# EAGLE design helmholtz-distribution-pcb (EAGLE 9.5.1)
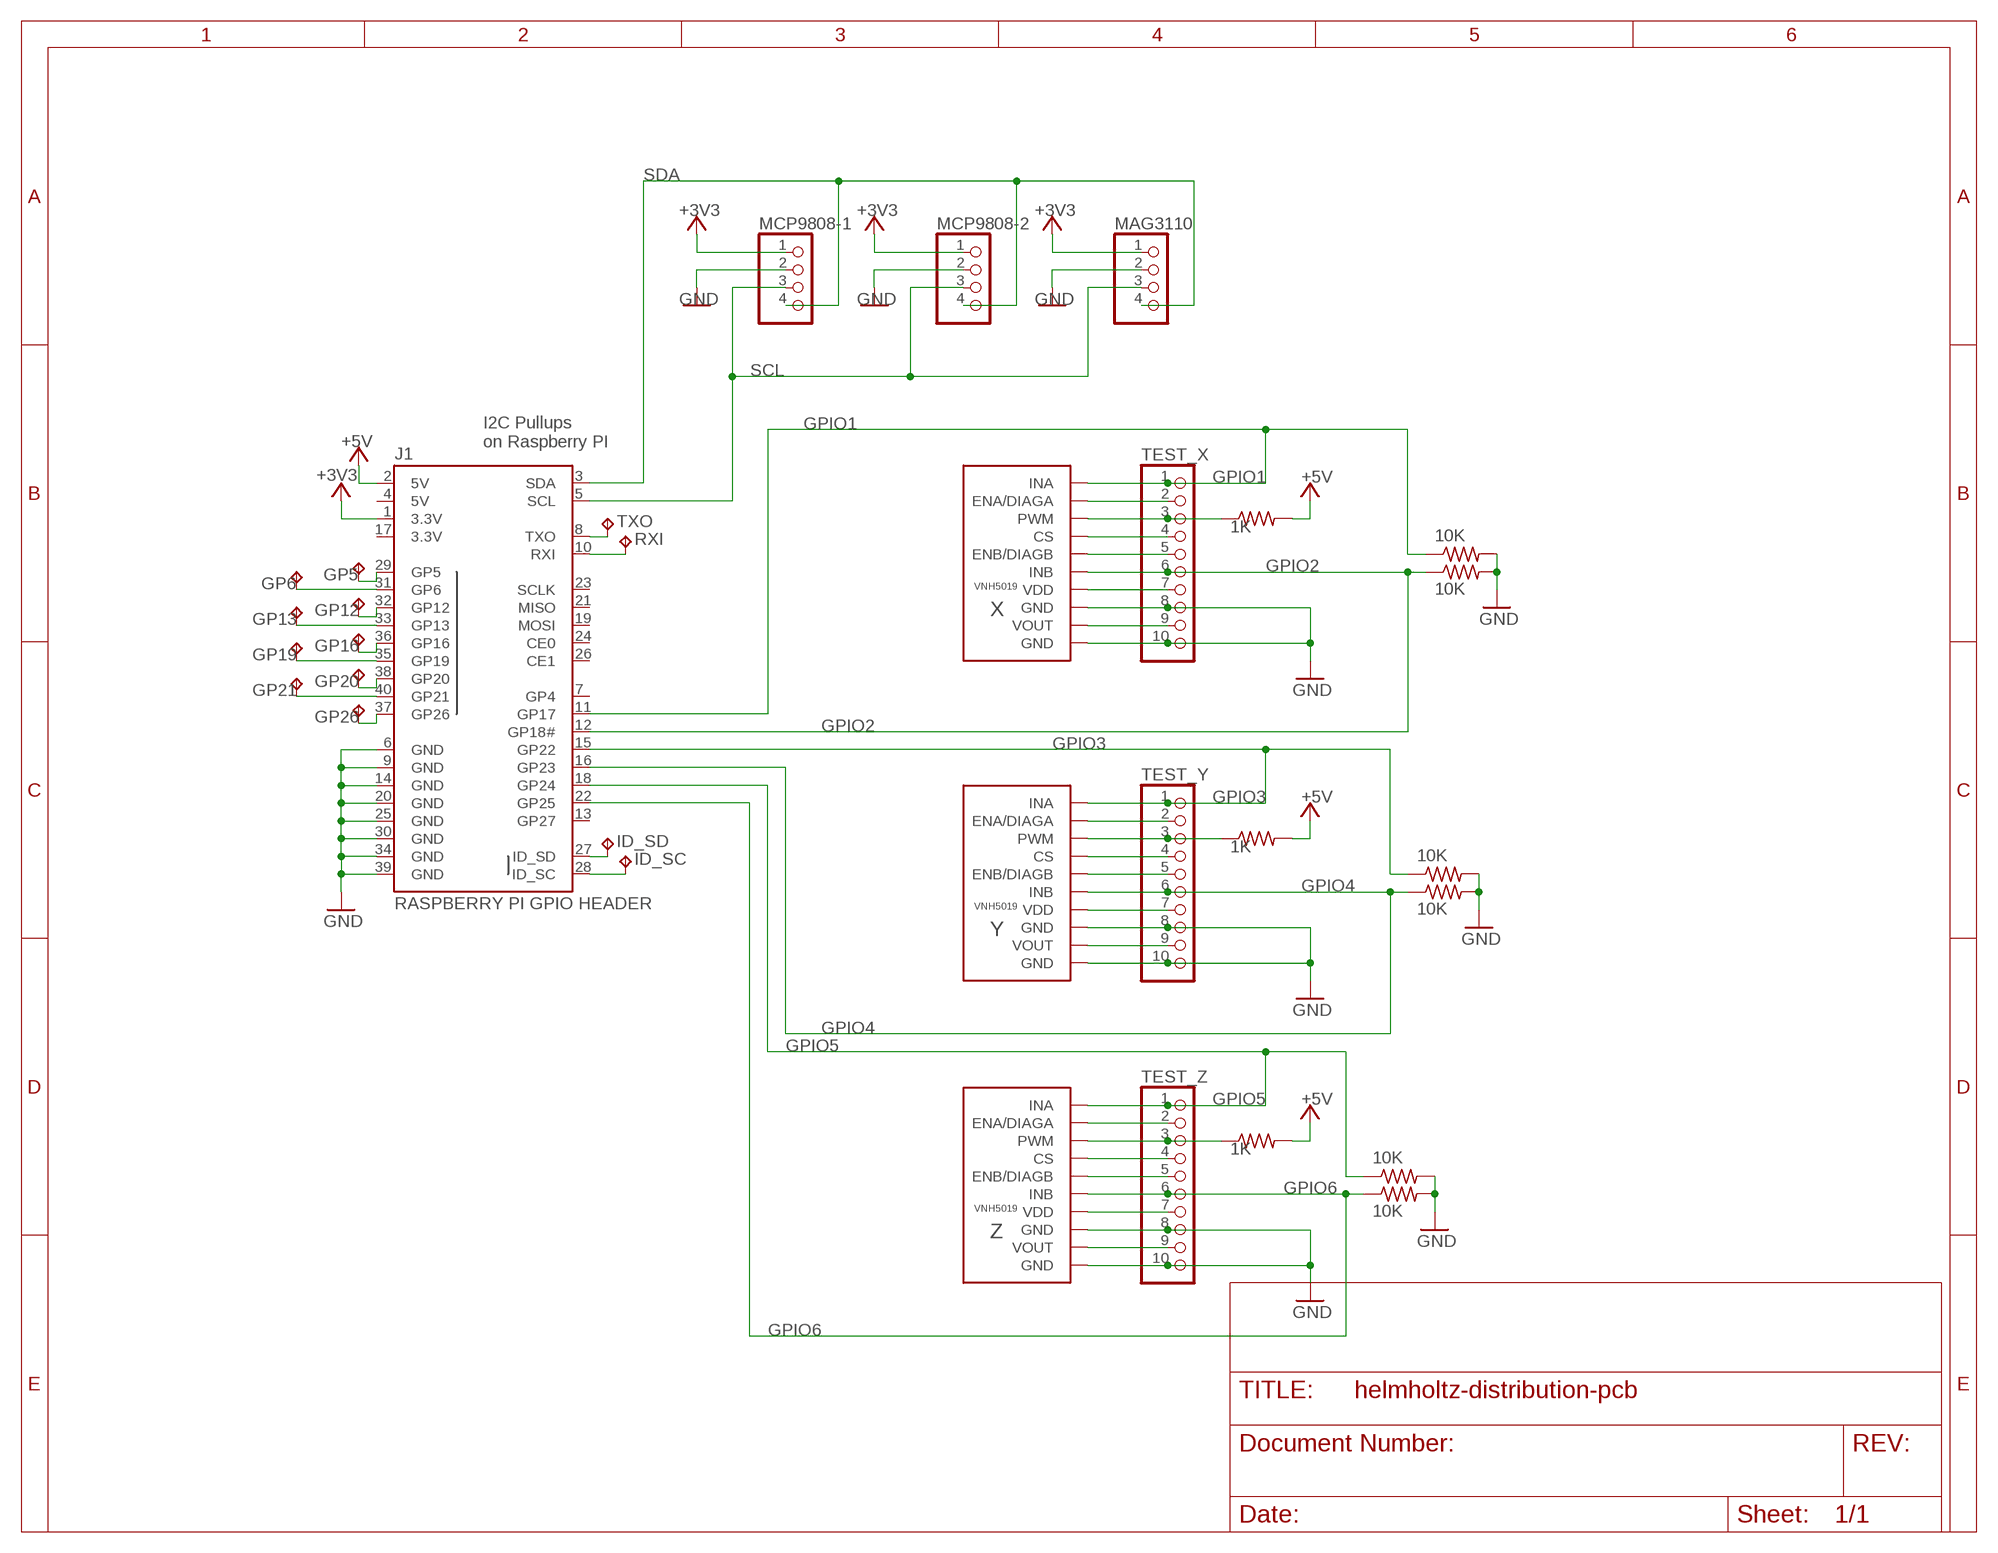
[diagram p0: schematic, sheet 1]

## Parts
GP5  TPPAD1-13  [P1-13]
GP6  TPPAD1-13  [P1-13]
GP12  TPPAD1-13  [P1-13]
GP13  TPPAD1-13  [P1-13]
GP16  TPPAD1-13  [P1-13]
GP19  TPPAD1-13  [P1-13]
GP20  TPPAD1-13  [P1-13]
GP21  TPPAD1-13  [P1-13]
GP26  TPPAD1-13  [P1-13]
ID_SC  TPPAD1-13  [P1-13]
ID_SD  TPPAD1-13  [P1-13]
J1  RASPBERRYPI-40-PIN-GPIO_PTH  [2X20_SHROUDED]
MAG3110  PINHD-1X4  [1X04]
MCP9808-1  PINHD-1X4  [1X04]
MCP9808-2  PINHD-1X4  [1X04]
R2  10K  R-US_R0603  [R0603]
R3  10K  R-US_R0603  [R0603]
R7  1K  R-US_R0603  [R0603]
R9  10K  R-US_R0603  [R0603]
R10  10K  R-US_R0603  [R0603]
R13  1K  R-US_R0603  [R0603]
R16  10K  R-US_R0603  [R0603]
R17  10K  R-US_R0603  [R0603]
R20  1K  R-US_R0603  [R0603]
RXI  TPPAD1-13  [P1-13]
TEST_X  PINHD-1X10  [1X10]
TEST_Y  PINHD-1X10  [1X10]
TEST_Z  PINHD-1X10  [1X10]
TXO  TPPAD1-13  [P1-13]
X  VNH5019  [VNH5019]
Y  VNH5019  [VNH5019]
Z  VNH5019  [VNH5019]

## Nets
+3V3: J1.1(3.3V) MAG3110.1 MCP9808-1.1 MCP9808-2.1
+5V: J1.2(5V) R7.2 R13.2 R20.2
CS_X: TEST_X.4 X.CS
CS_Y: TEST_Y.4 Y.CS
CS_Z: TEST_Z.4 Z.CS
ENA/DIAGA_X: TEST_X.2 X.ENA/DIAGA
ENA/DIAGA_Y: TEST_Y.2 Y.ENA/DIAGA
ENA/DIAGA_Z: TEST_Z.2 Z.ENA/DIAGA
ENB/DIAGB_X: TEST_X.5 X.EBN/DIAGB(ENB/DIAGB)
ENB/DIAGB_Y: TEST_Y.5 Y.EBN/DIAGB(ENB/DIAGB)
ENB/DIAGB_Z: TEST_Z.5 Z.EBN/DIAGB(ENB/DIAGB)
GND: J1.6(GND) J1.9(GND) J1.14(GND) J1.20(GND) J1.25(GND) J1.30(GND) J1.34(GND) J1.39(GND) MAG3110.2 MCP9808-1.2 MCP9808-2.2 R2.2 R3.2 R9.2 R10.2 R16.2 R17.2 TEST_X.8 TEST_X.10 TEST_Y.8 TEST_Y.10 TEST_Z.8 TEST_Z.10 X.GND@1(GND) X.GND@2(GND) Y.GND@1(GND) Y.GND@2(GND) Z.GND@1(GND) Z.GND@2(GND)
GPIO1: J1.11(GP17) R17.1 TEST_X.1 X.INA
GPIO2: J1.12(GP18#) R16.1 TEST_X.6 X.INB
GPIO3: J1.15(GP22) R10.1 TEST_Y.1 Y.INA
GPIO4: J1.16(GP23) R9.1 TEST_Y.6 Y.INB
GPIO5: J1.18(GP24) R3.1 TEST_Z.1 Z.INA
GPIO6: J1.22(GP25) R2.1 TEST_Z.6 Z.INB
N$1: GP26.TP J1.37(GP26)
N$2: GP21.TP J1.40(GP21)
N$3: GP20.TP J1.38(GP20)
N$4: GP19.TP J1.35(GP19)
N$5: GP16.TP J1.36(GP16)
N$6: GP13.TP J1.33(GP13)
N$7: GP12.TP J1.32(GP12)
N$8: GP6.TP J1.31(GP6)
N$9: GP5.TP J1.29(GP5)
N$10: J1.8(TXO) TXO.TP
N$11: J1.10(RXI) RXI.TP
N$12: ID_SD.TP J1.27(ID_SD)
N$13: ID_SC.TP J1.28(ID_SC)
PWM_X: R20.1 TEST_X.3 X.PWM
PWM_Y: R13.1 TEST_Y.3 Y.PWM
PWM_Z: R7.1 TEST_Z.3 Z.PWM
SCL: J1.5(SCL) MAG3110.3 MCP9808-1.3 MCP9808-2.3
SDA: J1.3(SDA) MAG3110.4 MCP9808-1.4 MCP9808-2.4
VDD_X: TEST_X.7 X.VDD
VDD_Y: TEST_Y.7 Y.VDD
VDD_Z: TEST_Z.7 Z.VDD
VOUT_X: TEST_X.9 X.VOUT
VOUT_Y: TEST_Y.9 Y.VOUT
VOUT_Z: TEST_Z.9 Z.VOUT
Unconnected: J1.7(GP4) J1.13(GP27) J1.19(MOSI) J1.21(MISO) J1.23(SCLK) J1.24(CE0) J1.26(CE1)

## Notes on the sheet
- I2C Pullups 
  on Raspberry PI
- X
- RASPBERRY PI GPIO HEADER
- Y
- Z

## Power pins joined to a net without a drawn wire
3.3V: J1.17(3.3V)
5V: J1.4(5V)

## Library data of the parts
GP5 GP6 GP12 GP13 GP16 GP19-GP21 GP26 ID_SC ID_SD RXI TXO = testpad:TP: Test pad
J1 = SparkFun-Connectors:RASPBERRYPI-40-PIN-GPIO: Raspberry Pi GPIO Header 2x20 pin connector, as found on B, B+, A+ models. Both shrouded PTH and SMT versions available. SparkFun Products: GPIO Shrouded Header <https://www.sparkfun.com/products/13054>- PTH SparkFun Pi Wedge (Preassembled) <https://www.sparkfun.com/products/13717>; PROD_ID: CONN-12263; SF_ID: PRT-13054
MAG3110 MCP9808-1 MCP9808-2 = pinhead:PINHD-1X4: PIN HEADER
R2 R3 R7 R9 R10 R13 R16 R17 R20 = rcl:R-US_: RESISTOR, American symbol; SPICEPREFIX: R
TEST_X TEST_Y TEST_Z = pinhead:PINHD-1X10: PIN HEADER
X Y Z = HelmholtzCage:VNH5019

## Board
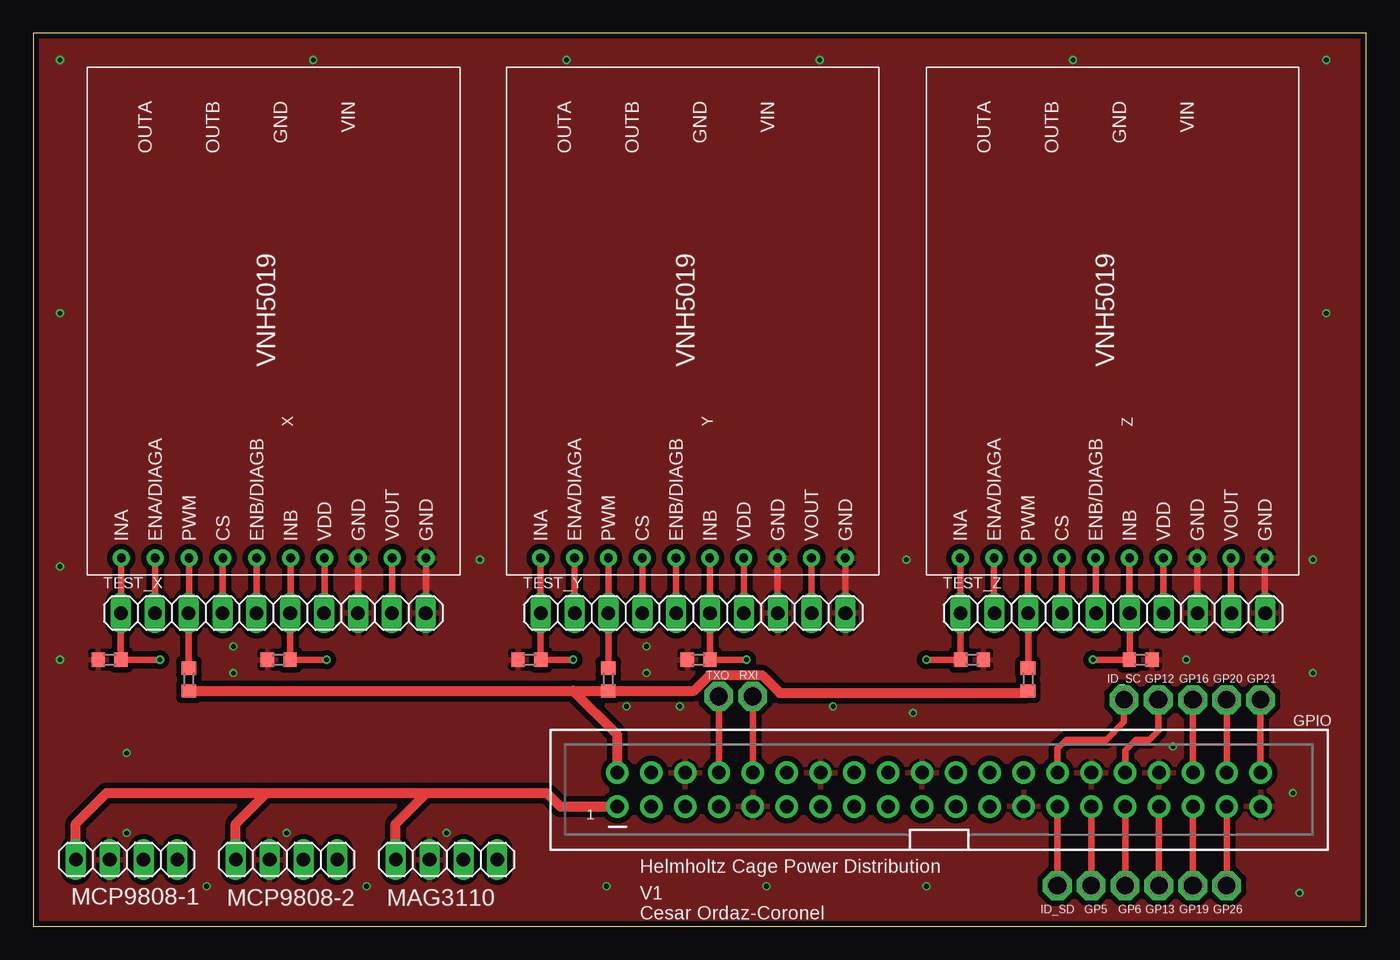
[diagram p1: board, top side]
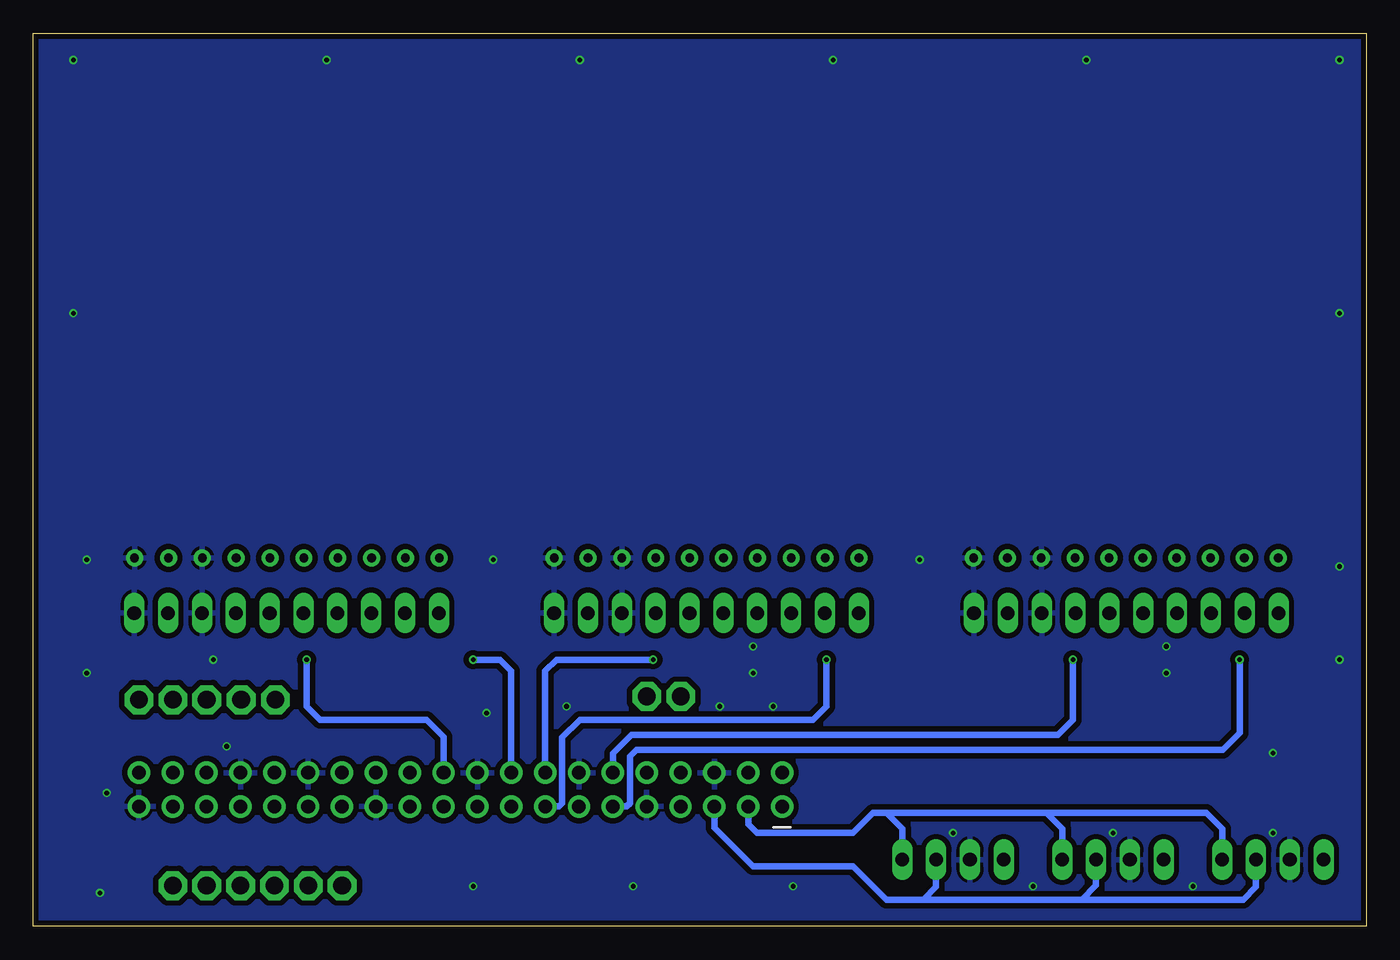
[diagram p2: board, bottom side, seen from below]

Size 100 x 67 mm. Coordinates in mm from the lower left corner, seen from the top.
Outline: 0,0 100,0 100,67 0,67 0,0
Copper layers (1*16): Top 0.035559375mm / dielectric 1.6mm / Bottom 0.035559375mm
Design rules "oshpark-2layer *": minimum track width 6mil, minimum drill 10mil, track to track 6mil, track to pad 6mil, pad to pad 6mil, via to via 6mil, smd to smd 6mil, copper to edge 15mil, drill to drill 6mil, minimum pad ring 5mil, minimum via ring 5mil, stop-mask expansion 2.5mil, vias tented up to drill 0.35mm, thermal gap 10mil

### Footprints (pad centres in the part's own frame; a part is rotated, then mirrored left to right if it is on the bottom)
P1-13 = drill 1.321 pad 2.159 octagon: TP 0,0
2X20_SHROUDED = drill 1.016 pad 1.676: 1 -1.27,24.13; 2 1.27,24.13; 3 -1.27,21.59; 4 1.27,21.59; 5 -1.27,19.05; 6 1.27,19.05; 7 -1.27,16.51; 8 1.27,16.51; 9 -1.27,13.97; 10 1.27,13.97; 11 -1.27,11.43; 12 1.27,11.43; 13 -1.27,8.89; 14 1.27,8.89; 15 -1.27,6.35; 16 1.27,6.35; 17 -1.27,3.81; 18 1.27,3.81; 19 -1.27,1.27; 20 1.27,1.27; 21 -1.27,-1.27; 22 1.27,-1.27; 23 -1.27,-3.81; 24 1.27,-3.81; 25 -1.27,-6.35; 26 1.27,-6.35; 27 -1.27,-8.89; 28 1.27,-8.89; 29 -1.27,-11.43; 30 1.27,-11.43; 31 -1.27,-13.97; 32 1.27,-13.97; 33 -1.27,-16.51; 34 1.27,-16.51; 35 -1.27,-19.05; 36 1.27,-19.05; 37 -1.27,-21.59; 38 1.27,-21.59; 39 -1.27,-24.13; 40 1.27,-24.13
1X04 = drill 1.016 long: 1 -3.81,0; 2 -1.27,0; 3 1.27,0; 4 3.81,0
R0603 = smd 1 x 1.1: 1 -0.85,0; 2 0.85,0
1X10 = drill 1.016 long: 1 -11.43,0; 2 -8.89,0; 3 -6.35,0; 4 -3.81,0; 5 -1.27,0; 6 1.27,0; 7 3.81,0; 8 6.35,0; 9 8.89,0; 10 11.43,0
VNH5019 = drill 0.65 pad 1.27: CS 36.83,10.16; EBN/DIAGB 36.83,12.7; ENA/DIAGA 36.83,5.08; GND@1 36.83,20.32; GND@2 36.83,25.4; INA 36.83,2.54; INB 36.83,15.24; PWM 36.83,7.62; VDD 36.83,17.78; VOUT 36.83,22.86

### Placement (x,y rotation side)
GP5  79.37,3.04 0 top
GP6  81.91,3.04 0 top
GP12  84.41,16.99 0 top
GP13  84.45,3.04 0 top
GP16  86.99,16.99 0 top
GP19  86.99,3.04 0 top
GP20  89.53,16.99 0 top
GP21  92.07,16.99 0 top
GP26  89.53,3.04 0 top
ID_SC  81.83,16.99 0 top
ID_SD  76.83,3.04 0 top
J1  67.95,10.25 90 top
MAG3110  31,5 0 top
MCP9808-1  7,5 0 top
MCP9808-2  19,5 0 top
R2  83.08,20 0 top
R3  70.43,20 0 top
R7  74.62,18.51 270 top
R9  49.92,20 180 top
R10  37.22,20 180 top
R13  43.14,18.51 270 top
R16  18.42,20 180 top
R17  5.72,20 180 top
R20  11.68,18.51 270 top
RXI  53.97,17.24 0 top
TEST_X  18,23.5 0 top
TEST_Y  49.5,23.5 0 top
TEST_Z  81,23.5 0 top
TXO  51.43,17.24 0 top
X  4.06,64.46 270 top
Y  35.52,64.46 270 top
Z  67,64.46 270 top

### Tracks (layer width: path | path; a pad name or v marks a point on that pad's centre or on a via)
+3V3
  Top 0.75: MCP9808-1.1 3.19,7.69 5.5,10 17.5,10 | MCP9808-2.1 15.19,7.69 17.5,10 | MAG3110.1 27.19,7.69 29.5,10 | 17.5,10 29.5,10 | 29.5,10 38.5,10 39.52,8.98 J1.1
+5V
  Top 0.75: R20.2 40.5,17.66 | 40.5,17.66 R13.2 49.58,17.66 50.76,18.85 54.65,18.85 56,17.5 74.46,17.5 R7.2 | J1.2 43.82,14.34 40.5,17.66
CS_X
  Top 0.5: X.CS 14.22,23.53 TEST_X.4
CS_Y
  Top 0.5: Y.CS TEST_Y.4
CS_Z
  Top 0.5: Z.CS 77.16,23.53 TEST_Z.4
ENA/DIAGA_X
  Top 0.5: X.ENA/DIAGA 9.14,23.53 TEST_X.2
ENA/DIAGA_Y
  Top 0.5: Y.ENA/DIAGA TEST_Y.2
ENA/DIAGA_Z
  Top 0.5: Z.ENA/DIAGA 72.08,23.53 TEST_Z.2
ENB/DIAGB_X
  Top 0.5: X.EBN/DIAGB 16.76,23.53 TEST_X.5
ENB/DIAGB_Y
  Top 0.5: Y.EBN/DIAGB TEST_Y.5
ENB/DIAGB_Z
  Top 0.5: Z.EBN/DIAGB 79.7,23.53 TEST_Z.5
GND  (via drill 0.35)
  Top 0.5: Z.GND@1 87.32,23.53 TEST_Z.8 | Z.GND@2 92.4,23.53 TEST_Z.10 | Y.GND@1 TEST_Y.8 | Y.GND@2 TEST_Y.10 | X.GND@2 29.46,23.53 TEST_X.10 | X.GND@1 24.38,23.53 TEST_X.8
  other vias: 46,19 46,21 86.5,20 15,19 15,21 2,20 19,7 7,7 31,7 25,3 13,3 7,13 43,3 55,3 67,3 95,2.5 96,19 96,27.5 65.5,27.5 33.5,27.5 2,27 44.5,16.5 48.5,16.5 60,16.5 66,16 94.5,10 85.5,13.5 2,46 2,65 21,65 40,65 59,65 78,65 97,65 97,46
  pour Top (isolate 0.406): 0,0 0,67 100,67 100,0
  pour Bottom (isolate 0.406): 0,0 0,67 100,67 100,0
GPIO1  (via drill 0.35)
  Top 0.5: X.INA 6.6,23.53 TEST_X.1 R17.1 v9.5,20
  Bottom 0.5: J1.11 55.5,8.98 55.25,9.23 55.25,12.75 54.75,13.25 10.75,13.25 9.5,14.5 v9.5,20
GPIO2  (via drill 0.35)
  Top 0.5: X.INB 19.3,23.53 TEST_X.6 R16.1 v22,20
  Bottom 0.5: J1.12 56.52,12.98 55.12,14.38 23.12,14.38 22,15.5 v22,20
GPIO3  (via drill 0.35)
  Top 0.5: Y.INA TEST_Y.1 R10.1 v40.5,20
  Bottom 0.5: J1.15 60.57,8.98 60.34,9.21 60.34,14.16 59,15.5 41.5,15.5 40.5,16.5 v40.5,20
GPIO4  (via drill 0.35)
  Top 0.5: v53.5,20 R9.1 50.77,20.02 TEST_Y.6 Y.INB
  Bottom 0.5: J1.16 61.6,19.15 60.75,20 v53.5,20
GPIO5  (via drill 0.35)
  Top 0.5: 69.54,20.04 R3.1 | v67,20 69.5,20 69.54,20.04 | Z.INA 69.54,23.53 TEST_Z.1 69.57,20.07 69.54,20.04
  Bottom 0.5: J1.18 64.14,19.14 65,20 v67,20
GPIO6  (via drill 0.35)
  Top 0.5: Z.INB 82.24,23.53 TEST_Z.6 82.27,20.04 R2.1 v79.5,20
  Bottom 0.5: J1.22 69.22,14.22 70.5,15.5 78.5,15.5 79.5,16.5 v79.5,20
N$1
  Top 0.5: J1.37 GP26.TP
N$2
  Top 0.5: GP21.TP J1.40
N$3
  Top 0.5: J1.38 GP20.TP
N$4
  Top 0.5: J1.35 GP19.TP
N$5
  Top 0.5: GP16.TP J1.36
N$6
  Top 0.5: GP13.TP J1.33
N$7
  Top 0.5: J1.32 81.92,13.19 82.73,14 83.74,14 84.41,14.67 GP12.TP
N$8
  Top 0.5: J1.31 GP6.TP
N$9
  Top 0.5: J1.29 GP5.TP
N$10
  Top 0.5: TXO.TP J1.8
N$11
  Top 0.5: J1.10 RXI.TP
N$12
  Top 0.5: J1.27 ID_SD.TP
N$13
  Top 0.5: J1.28 76.84,13.34 77.5,14 80.5,14 81.83,15.33 ID_SC.TP
PWM_X
  Top 0.5: X.PWM 11.68,23.53 TEST_X.3 11.65,19.39 R20.1
PWM_Y
  Top 0.5: Y.PWM TEST_Y.3 R13.1
PWM_Z
  Top 0.5: Z.PWM 74.62,23.53 TEST_Z.3 74.65,19.39 R7.1
SCL
  Bottom 0.5: MAG3110.3 32.27,2.96 33.23,2 | MCP9808-2.3 20.27,3.06 21.33,2 | MCP9808-1.3 8.27,2.94 9.21,2 21.33,2 | 21.33,2 33.23,2 | 33.23,2 36,2 38.5,4.5 46,4.5 48.9,7.4 J1.5
SDA
  Bottom 0.5: MAG3110.4 34.81,7.31 36,8.5 | MCP9808-2.4 22.81,7.31 24,8.5 | MCP9808-1.4 10.81,7.31 12,8.5 24,8.5 | 24,8.5 36,8.5 | 36,8.5 37,8.5 38.5,7 45.7,7 46.36,7.66 J1.3
VDD_X
  Top 0.5: X.VDD 21.84,23.53 TEST_X.7
VDD_Y
  Top 0.5: Y.VDD TEST_Y.7
VDD_Z
  Top 0.5: Z.VDD 84.78,23.53 TEST_Z.7
VOUT_X
  Top 0.5: X.VOUT 26.92,23.53 TEST_X.9
VOUT_Y
  Top 0.5: Y.VOUT TEST_Y.9
VOUT_Z
  Top 0.5: Z.VOUT 89.86,23.53 TEST_Z.9

### Text on the board
tPlace: Helmholtz Cage Power Distribution | V1 | Cesar Ordaz-Coronel
tNames: X | Y | Z | GPIO | 1